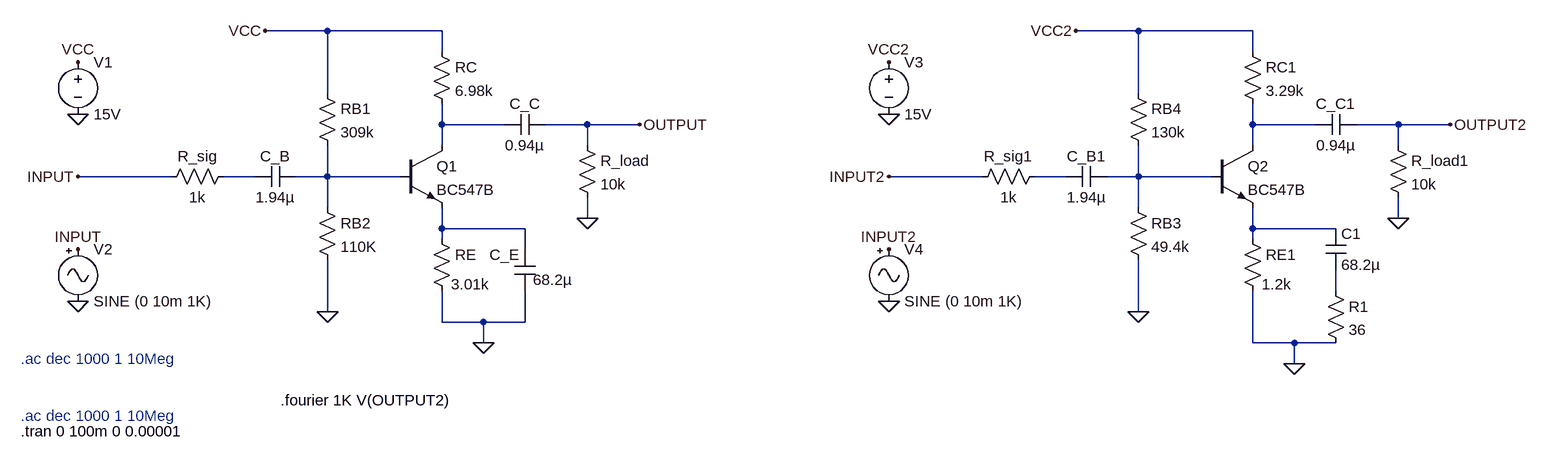
[diagram p0: schematic classicBJTDesign.asc]
classicBJTDesign.asc, the LTspice schematic file:
Version 4
SHEET 1 1776 680
WIRE -80 -112 -176 -112
WIRE 96 -112 -80 -112
WIRE 1168 -112 1072 -112
WIRE 1344 -112 1168 -112
WIRE 96 -80 96 -112
WIRE 1344 -80 1344 -112
WIRE -80 -16 -80 -112
WIRE 1168 -16 1168 -112
WIRE 96 32 96 0
WIRE 192 32 96 32
WIRE 320 32 256 32
WIRE 400 32 320 32
WIRE 1344 32 1344 0
WIRE 1440 32 1344 32
WIRE 1568 32 1504 32
WIRE 1648 32 1568 32
WIRE 96 64 96 32
WIRE 320 64 320 32
WIRE 1344 64 1344 32
WIRE 1568 64 1568 32
WIRE -320 112 -464 112
WIRE -192 112 -240 112
WIRE -80 112 -80 64
WIRE -80 112 -128 112
WIRE 32 112 -80 112
WIRE 928 112 784 112
WIRE 1056 112 1008 112
WIRE 1168 112 1168 64
WIRE 1168 112 1120 112
WIRE 1280 112 1168 112
WIRE -80 160 -80 112
WIRE 1168 160 1168 112
WIRE 320 176 320 144
WIRE 1568 176 1568 144
WIRE 96 192 96 160
WIRE 224 192 96 192
WIRE 1344 192 1344 160
WIRE 1472 192 1344 192
WIRE 96 208 96 192
WIRE 1344 208 1344 192
WIRE 224 224 224 192
WIRE 1472 288 1472 256
WIRE -80 320 -80 240
WIRE 1168 320 1168 240
WIRE 96 336 96 288
WIRE 160 336 96 336
WIRE 224 336 224 288
WIRE 224 336 160 336
WIRE 160 368 160 336
WIRE 1344 368 1344 288
WIRE 1408 368 1344 368
WIRE 1472 368 1408 368
WIRE 1408 400 1408 368
FLAG 320 176 0
FLAG -80 320 0
FLAG 160 368 0
FLAG -464 112 INPUT
FLAG -464 224 INPUT
FLAG -176 -112 VCC
FLAG -464 -64 VCC
FLAG 400 32 OUTPUT
FLAG -464 304 0
FLAG -464 16 0
FLAG 1568 176 0
FLAG 1168 320 0
FLAG 1408 400 0
FLAG 784 112 INPUT2
FLAG 784 224 INPUT2
FLAG 1072 -112 VCC2
FLAG 784 -64 VCC2
FLAG 1648 32 OUTPUT2
FLAG 784 304 0
FLAG 784 16 0
SYMBOL res -96 144 R0
SYMATTR InstName RB2
SYMATTR Value 110K
SYMBOL res -96 -32 R0
SYMATTR InstName RB1
SYMATTR Value 309k
SYMBOL res 80 -96 R0
SYMATTR InstName RC
SYMATTR Value 6.98k
SYMBOL res 80 192 R0
WINDOW 3 30 86 Left 2
SYMATTR Value 3.01k
SYMATTR InstName RE
SYMBOL res 304 48 R0
SYMATTR InstName R_load
SYMATTR Value 10k
SYMBOL res -224 96 R90
WINDOW 0 0 56 VBottom 2
WINDOW 3 32 56 VTop 2
SYMATTR InstName R_sig
SYMATTR Value 1k
SYMBOL cap -128 96 R90
WINDOW 0 0 32 VBottom 2
WINDOW 3 32 32 VTop 2
SYMATTR InstName C_B
SYMATTR Value 1.94µ
SYMBOL cap 256 16 R90
WINDOW 0 0 32 VBottom 2
WINDOW 3 32 32 VTop 2
SYMATTR InstName C_C
SYMATTR Value 0.94µ
SYMBOL cap 240 288 R180
WINDOW 0 24 56 Left 2
WINDOW 3 -57 17 Left 2
SYMATTR InstName C_E
SYMATTR Value 68.2µ
SYMBOL voltage -464 -80 R0
SYMATTR InstName V1
SYMATTR Value 15V
SYMBOL Misc\\signal -464 208 R0
SYMATTR InstName V2
SYMATTR Value SINE (0 10m 1K)
SYMBOL npn 32 64 R0
SYMATTR InstName Q1
SYMATTR Value BC547B
SYMBOL res 1152 144 R0
SYMATTR InstName RB3
SYMATTR Value 49.4k
SYMBOL res 1152 -32 R0
SYMATTR InstName RB4
SYMATTR Value 130k
SYMBOL res 1328 -96 R0
SYMATTR InstName RC1
SYMATTR Value 3.29k
SYMBOL res 1328 192 R0
WINDOW 3 30 86 Left 2
SYMATTR Value 1.2k
SYMATTR InstName RE1
SYMBOL res 1552 48 R0
SYMATTR InstName R_load1
SYMATTR Value 10k
SYMBOL res 1024 96 R90
WINDOW 0 0 56 VBottom 2
WINDOW 3 32 56 VTop 2
SYMATTR InstName R_sig1
SYMATTR Value 1k
SYMBOL cap 1120 96 R90
WINDOW 0 0 32 VBottom 2
WINDOW 3 32 32 VTop 2
SYMATTR InstName C_B1
SYMATTR Value 1.94µ
SYMBOL cap 1504 16 R90
WINDOW 0 0 32 VBottom 2
WINDOW 3 32 32 VTop 2
SYMATTR InstName C_C1
SYMATTR Value 0.94µ
SYMBOL voltage 784 -80 R0
SYMATTR InstName V3
SYMATTR Value 15V
SYMBOL Misc\\signal 784 208 R0
SYMATTR InstName V4
SYMATTR Value SINE (0 10m 1K)
SYMBOL npn 1280 64 R0
SYMATTR InstName Q2
SYMATTR Value BC547B
SYMBOL cap 1456 192 R0
SYMATTR InstName C1
SYMATTR Value 68.2µ
SYMBOL res 1456 272 R0
SYMATTR InstName R1
SYMATTR Value 36
TEXT -552 392 Left 2 ;.ac dec 1000 1 10Meg
TEXT -152 456 Left 2 !.fourier 1K V(OUTPUT2)
TEXT -552 480 Left 2 ;.ac dec 1000 1 10Meg
TEXT -552 504 Left 2 !.tran 0 100m 0 0.00001

The netlist it stands for:
* classicBJTDesign.asc
RB2 N004 0 110K
RB1 VCC N004 309k
RC VCC N001 6.98k
RE N007 0 3.01k
R_load OUTPUT 0 10k
R_sig N003 INPUT 1k
C_B N004 N003 1.94µ
C_C OUTPUT N001 0.94µ
C_E 0 N007 68.2µ
V1 VCC 0 15V
V2 INPUT 0 SINE (0 10m 1K)
Q1 N001 N004 N007 0 BC547B
RB3 N006 0 49.4k
RB4 VCC2 N006 130k
RC1 VCC2 N002 3.29k
RE1 N008 0 1.2k
R_load1 OUTPUT2 0 10k
R_sig1 N005 INPUT2 1k
C_B1 N006 N005 1.94µ
C_C1 OUTPUT2 N002 0.94µ
V3 VCC2 0 15V
V4 INPUT2 0 SINE (0 10m 1K)
Q2 N002 N006 N008 0 BC547B
C1 N008 N009 68.2µ
R1 N009 0 36
.model NPN NPN
.model PNP PNP
.lib standard.bjt
* .ac dec 1000 1 10Meg
.fourier 1K V(OUTPUT2)
* .ac dec 1000 1 10Meg
.tran 0 100m 0 0.00001
.backanno
.end